# Altium schematic sheet CY8C4124LQI-S413.SchDoc: CY8C4125AZI-S433
size A3; SheetNumber: 2; SheetTotal: 3
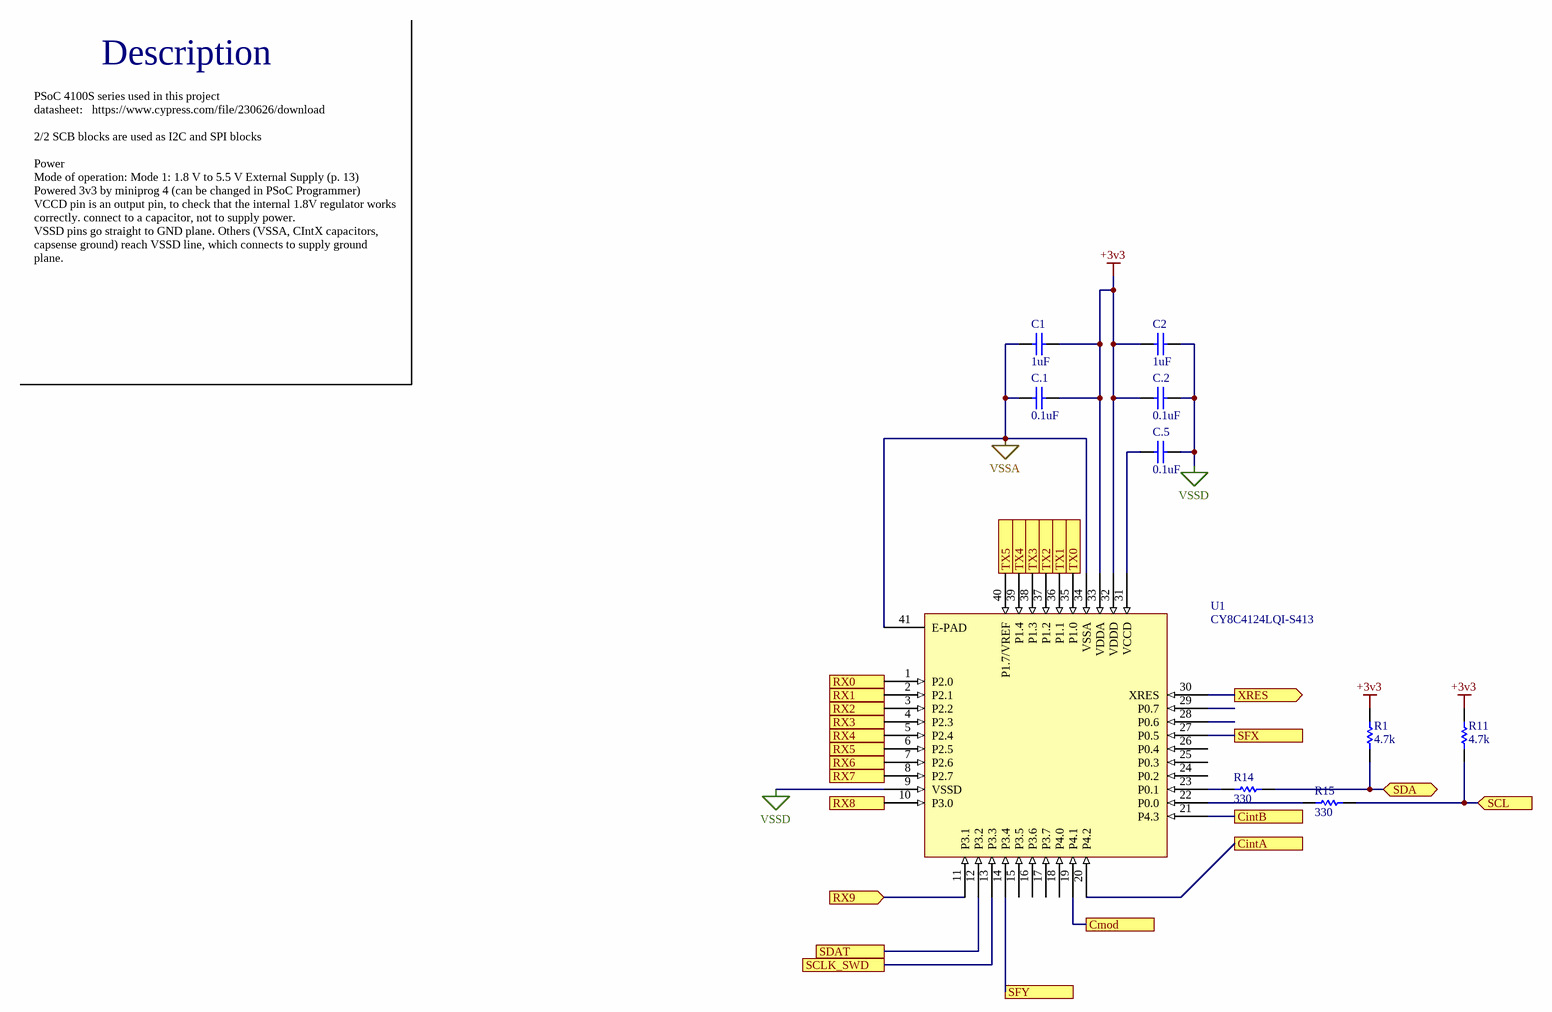
[diagram p0: CY8C4124LQI-S413.SchDoc]

## Parts
C1  1uF  [CAPC1005X56X25ML10T15]
C2  1uF  [CAPC1005X56X25ML10T15]
C.1  0.1uF  [CAPC1005X56X25ML10T15]
C.2  0.1uF  [CAPC1005X56X25ML10T15]
C.5  0.1uF  [CAPC1005X56X25ML10T15]
R1  4.7k  [RESC1005X40X25ML05T10]
R11  4.7k  [RESC1005X40X25ML05T10]
R14  330  [RESC1005X40X25ML05T10]
R15  330  [RESC1005X40X25ML05T10]
U1  CY8C4124LQI-S413  [CY8C4125LQS-S423]

## Ports
CintA, CintB, Cmod, RX0 (in), RX1 (in), RX2 (in), RX3 (in), RX4 (in), RX5 (in), RX6 (in), RX7 (in), RX8 (in), RX9 (in), SCL (in), SCLK_SWD, SDA (bidir), SDAT, SFX, SFY, TX0 (out), TX1 (out), TX2 (out), TX3 (out), TX4 (out), TX5 (out), XRES (out)

## Nets
+3v3: C1.2 C2.1 C.1.2 C.2.1 R1.2 R11.2 U1.32(VDDD) U1.33(VDDA)
VSSA: C1.1 C.1.1 U1.34(VSSA) U1.41(E-PAD)
VSSD: C2.2 C.2.2 C.5.2 U1.9(VSSD)
CintA: U1.20(P4.2) ; port CintA
CintB: U1.21(P4.3) ; port CintB
Cmod: U1.19(P4.1) ; port Cmod
RX0: U1.1(P2.0) ; port RX0
RX1: U1.2(P2.1) ; port RX1
RX2: U1.3(P2.2) ; port RX2
RX3: U1.4(P2.3) ; port RX3
RX4: U1.5(P2.4) ; port RX4
RX5: U1.6(P2.5) ; port RX5
RX6: U1.7(P2.6) ; port RX6
RX7: U1.8(P2.7) ; port RX7
RX8: U1.10(P3.0) ; port RX8
RX9: U1.11(P3.1) ; port RX9
SCL: R11.1 R15.2 ; port SCL
SCLK_SWD: U1.13(P3.3) ; port SCLK_SWD
SDA: R1.1 R14.2 ; port SDA
SDAT: U1.12(P3.2) ; port SDAT
SFX: U1.27(P0.5) ; port SFX
SFY: U1.14(P3.4) ; port SFY
TX0: U1.35(P1.0) ; port TX0
TX1: U1.36(P1.1) ; port TX1
TX2: U1.37(P1.2) ; port TX2
TX3: U1.38(P1.3) ; port TX3
TX4: U1.39(P1.4) ; port TX4
TX5: U1.40(P1.7/VREF) ; port TX5
XRES: U1.30(XRES) ; port XRES
NetC.5_1: C.5.1 U1.31(VCCD)
NetR14_1: R14.1 U1.23(P0.1)
NetR15_1: R15.1 U1.22(P0.0)

Not connected (* = marked no-connect by the designer): U1 15(P3.5) 16(P3.6) 17(P3.7) 18(P4.0) 24(P0.2) 25(P0.3) 26(P0.4) 28(P0.6) 29(P0.7)

## Notes on the sheet
- Description
- PSoC 4100S series used in this project
  datasheet:   https://www.cypress.com/file/230626/download
  2/2 SCB blocks are used as I2C and SPI blocks
  Power
  Mode of operation: Mode 1: 1.8 V to 5.5 V External Supply (p. 13)
  Powered 3v3 by miniprog 4 (can be changed in PSoC Programmer)
  VCCD pin is an output pin, to check that the internal 1.8V regulator works correctly. connect to a capacitor, not to supply power.
  VSSD pins go straight to GND plane. Others (VSSA, CIntX capacitors, capsense ground) reach VSSD line, which connects to supply ground plane.
- Title
- Size:
- Date:
- A3
- Number:
- Time:
- Revision:
- Sheet
- of
- File:

## Library data of the parts
C1 C2 C.1 C.2 C.5 = CMP-1034-02113-2: Manufacturer: AVX Interconnect / Elco; Part Number: 04026D105KAT2A
R1 R11 R14 R15 = CMP-2002-07972-1: Part Number: RC0402JR-072KL; Manufacturer: Yageo / Phycomp